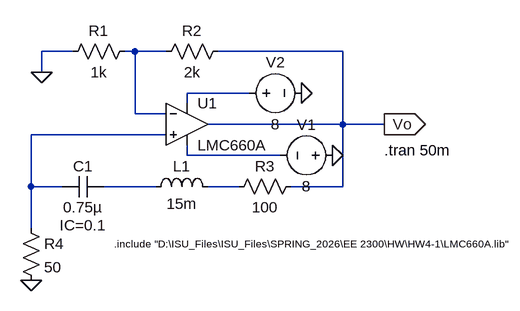
[diagram p0: schematic P3d.asc]
P3d.asc, the LTspice schematic file:
Version 4.1
SHEET 1 972 680
WIRE -80 -112 -128 -112
WIRE 16 -112 0 -112
WIRE 64 -112 16 -112
WIRE 336 -112 144 -112
WIRE -128 -80 -128 -112
WIRE 192 -48 96 -48
WIRE 96 -32 96 -48
WIRE 16 -16 16 -112
WIRE 64 -16 16 -16
WIRE 336 0 336 -112
WIRE 336 0 128 0
WIRE 400 0 336 0
WIRE 64 16 -144 16
WIRE 96 48 96 32
WIRE 240 48 96 48
WIRE -144 96 -144 16
WIRE -96 96 -144 96
WIRE 48 96 -32 96
WIRE 176 96 128 96
WIRE 336 96 336 0
WIRE 336 96 256 96
WIRE -144 160 -144 96
FLAG 272 -48 0
FLAG 320 48 0
FLAG -144 240 0
FLAG -128 -80 0
FLAG 400 0 Vo
IOPIN 400 0 Out
SYMBOL OpAmps\\opamp2 96 -64 R0
SYMATTR InstName U1
SYMATTR Value LMC660A
SYMBOL res 16 -128 R90
WINDOW 0 0 56 VBottom 2
WINDOW 3 32 56 VTop 2
SYMATTR InstName R1
SYMATTR Value 1k
SYMBOL res 160 -128 R90
WINDOW 0 0 56 VBottom 2
WINDOW 3 32 56 VTop 2
SYMATTR InstName R2
SYMATTR Value 2k
SYMBOL res 272 80 R90
WINDOW 0 0 56 VBottom 2
WINDOW 3 32 56 VTop 2
SYMATTR InstName R3
SYMATTR Value 100
SYMBOL cap -32 80 R90
WINDOW 0 0 32 VBottom 2
WINDOW 3 32 32 VTop 2
WINDOW 39 60 32 VTop 2
SYMATTR InstName C1
SYMATTR Value 0.75µ
SYMATTR SpiceLine IC=0.1
SYMBOL ind 32 112 R270
WINDOW 0 32 56 VTop 2
WINDOW 3 5 56 VBottom 2
SYMATTR InstName L1
SYMATTR Value 15m
SYMATTR SpiceLine Rser=1m
SYMBOL res -160 144 R0
SYMATTR InstName R4
SYMATTR Value 50
SYMBOL voltage 336 48 R90
WINDOW 0 -32 56 VBottom 2
WINDOW 3 32 56 VTop 2
WINDOW 123 0 0 Left 0
WINDOW 39 0 0 Left 0
SYMATTR InstName V1
SYMATTR Value 8
SYMBOL voltage 176 -48 R270
WINDOW 0 32 56 VTop 2
WINDOW 3 -32 56 VBottom 2
WINDOW 123 0 0 Left 0
WINDOW 39 0 0 Left 0
SYMATTR InstName V2
SYMATTR Value 8
TEXT -16 184 Left 1 !.include "D:\\ISU_Files\\ISU_Files\\SPRING_2026\\EE 2300\\HW\\HW4-1\\LMC660A.lib"
TEXT 400 40 Left 2 !.tran 50m

The netlist it stands for:
* P3d.asc
X§U1 N003 N001 N002 N004 Vo LMC660A  ; pins In+ In- V+ V- OUT
R1 N001 0 1k
R2 Vo N001 2k
R3 Vo N006 100
C1 N005 N003 0.75µ IC=0.1
L1 N005 N006 15m Rser=1m
R4 N003 0 50
V1 0 N004 8
V2 N002 0 8
.include "D:\ISU_Files\ISU_Files\SPRING_2026\EE 2300\HW\HW4-1\LMC660A.lib"
.tran 50m
.backanno
.end